# EAGLE schematic week 5 (EAGLE 9.6.2)
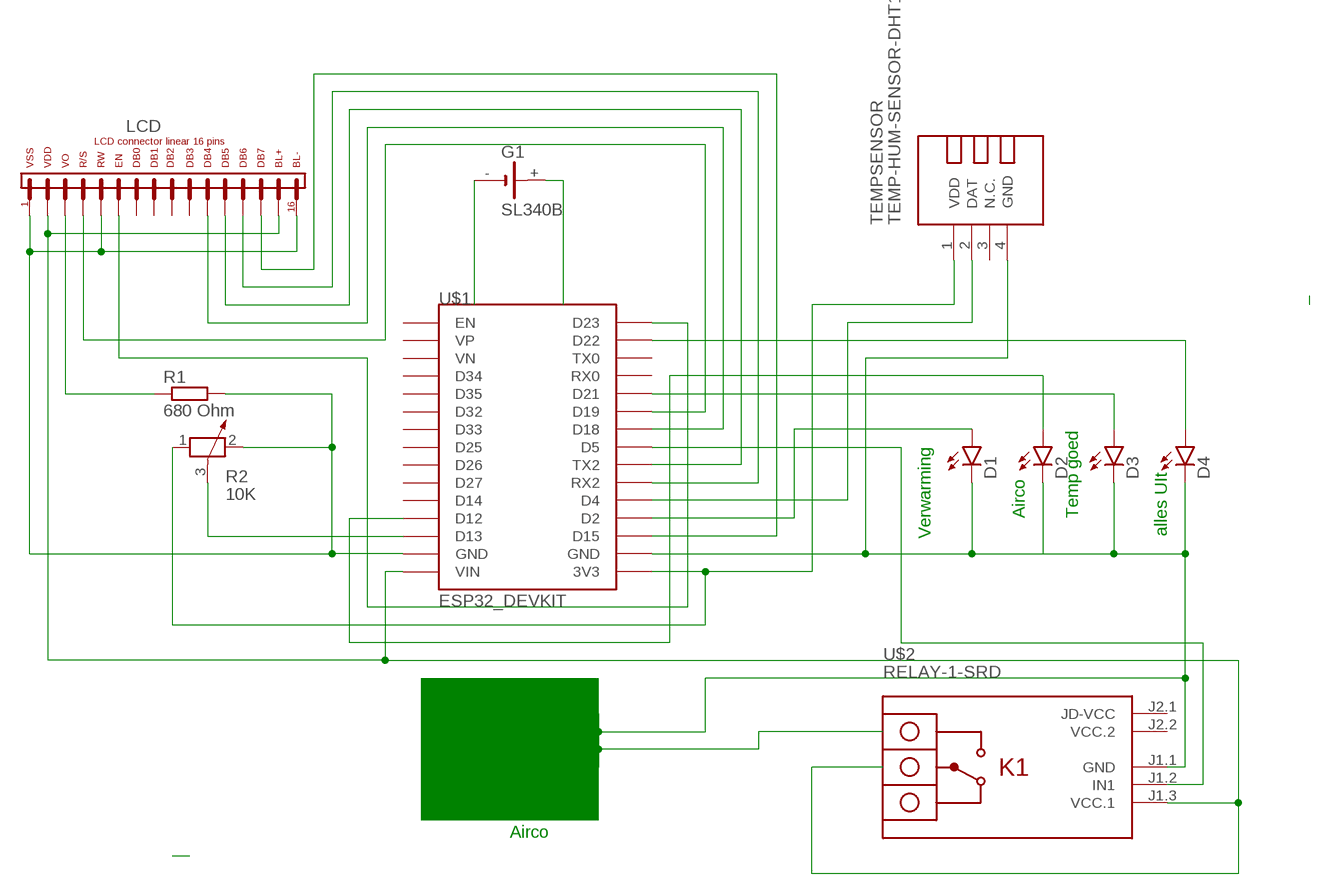
[diagram p0: schematic, sheet 1]

## Parts
D1  U57X32  [U57X32]
D2  U57X32  [U57X32]
D3  U57X32  [U57X32]
D4  U57X32  [U57X32]
G1  SL340B  [SL-340/B3.6V]
LCD  -LCD2X16  [CON8X2LCD]
R1  680 Ohm  R-EU_0207/10  [0207/10]
R2  10K  POTENTIOMETER_PT_SPIN  [PT-SPIN]
TEMPSENSOR  TEMP-HUM-SENSOR-DHT11  [TEMP-HUM-SENSOR-DHT11]
U$1  ESP32_DEVKIT  [ESP32_DEVKIT]
U$2  RELAY-1-SRD  [RELAY-1-SRD]

## Nets
N$1: G1.-
N$2: G1.+
N$3: LCD.P$3(V0) R1.1
N$4: LCD.P$1(VSS) LCD.P$4(RW) LCD.P$16(BKL-) R1.2 R2.2 U$1.GND@1(GND)
N$5: R2.3 U$1.D13
N$6: U$1.D5 U$2.J1.2(IN1)
N$7: D4.A U$1.D22
N$8: D1.K(C) D2.K(C) D3.K(C) D4.K(C) TEMPSENSOR.4(GND) U$1.GND@2(GND) U$2.J1.1(GND)
N$11: R2.1 TEMPSENSOR.1(VDD) U$1.3V3
N$12: LCD.P$5(R/S) U$1.D19
N$13: LCD.P$14(DB7) U$1.D15
N$15: LCD.P$13(DB6) U$1.RX2
N$17: D3.A U$1.D21
N$18: LCD.P$2(VDD) LCD.P$15(BKL+) U$1.VIN U$2.J1.3(VCC.1)
N$19: LCD.P$12(DB5) U$1.TX2
N$20: TEMPSENSOR.2(DAT) U$1.D4
N$21: D2.A U$1.D12
N$22: LCD.P$6(EN) U$1.D23
N$23: D1.A U$1.D2
N$25: LCD.P$11(DB4) U$1.D18
Unconnected: LCD.P$7(DB0) LCD.P$8(DB1) LCD.P$9(DB2) LCD.P$10(DB3) TEMPSENSOR.3(N.C.) U$1.D14 U$1.D25 U$1.D26 U$1.D27 U$1.D32 U$1.D33 U$1.D34 U$1.D35 U$1.EN U$1.RX0 U$1.TX0 U$1.VN U$1.VP U$2.J2.1(JD-VCC)

## Notes on the sheet
- Verwarming
- Airco | Temp goed
- alles UIt
- Airco

## Power pins joined to a net without a drawn wire
VCC.2: U$2.J2.2(VCC.2)

## Library data of the parts
D1-D4 = led:U57X32: LED rectangle, 5.7 x 3.2 mm
G1 = battery:SL340B: LI BATTERY Sonnenschein SL-340 B 3.6 V
LCD = LCD 16.2:-LCD2X16
R1 = rcl:R-EU_: RESISTOR, European symbol; SPICEPREFIX: R
R2 = rcl:POTENTIOMETER_: Potentiometer; SPICEMODEL: POT; SPICEPREFIX: X
TEMPSENSOR = diy-modules:TEMP-HUM-SENSOR-DHT11: DHT11 - digital humidity & temperature sensor DHT11 datasheet available here: https://akizukidenshi.com/download/ds/aosong/DHT11.pdf Click here to find device on ebay.com <http://www.ebay.com/sch/dht11+digital+sensor>
U$1 = DOIT_ESP32_DEVKIT:ESP32_DEVKIT: ESP32 DEVKIT BOARD
U$2 = diy-modules:RELAY-1-SRD: 1-Channel Relay Module based on SRD-05VDC-SL-C relays Click here to find device on ebay.com <http://www.ebay.com/sch/one+channel+isolated+relay+5v>